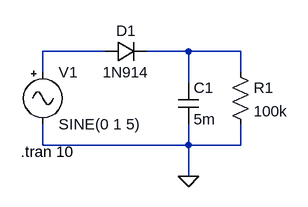
[diagram p0: schematic AC-DCconverter.asc]
AC-DCconverter.asc, the LTspice schematic file:
Version 4
SHEET 1 880 680
WIRE 176 96 80 96
WIRE 304 96 240 96
WIRE 384 96 304 96
WIRE 80 128 80 96
WIRE 384 128 384 96
WIRE 304 144 304 96
WIRE 80 240 80 208
WIRE 304 240 304 208
WIRE 304 240 80 240
WIRE 384 240 384 208
WIRE 384 240 304 240
WIRE 304 288 304 240
FLAG 304 288 0
SYMBOL Misc\\signal 80 112 R0
WINDOW 123 0 0 Left 0
WINDOW 39 0 0 Left 0
SYMATTR InstName V1
SYMATTR Value SINE(0 1 5)
SYMBOL diode 176 112 R270
WINDOW 0 32 32 VTop 2
WINDOW 3 0 32 VBottom 2
SYMATTR InstName D1
SYMATTR Value 1N914
SYMBOL res 368 112 R0
SYMATTR InstName R1
SYMATTR Value 100k
SYMBOL cap 288 144 R0
SYMATTR InstName C1
SYMATTR Value 5m
TEXT 46 250 Left 2 !.tran 10

The netlist it stands for:
* AC-DCconverter.asc
V1 N001 0 SINE(0 1 5)
D1 N001 N002 1N914
R1 N002 0 100k
C1 N002 0 5m
.model D D
.lib standard.dio
.tran 10
.backanno
.end